# EAGLE design rear_wheel_encoder (EAGLE 7.6.0)
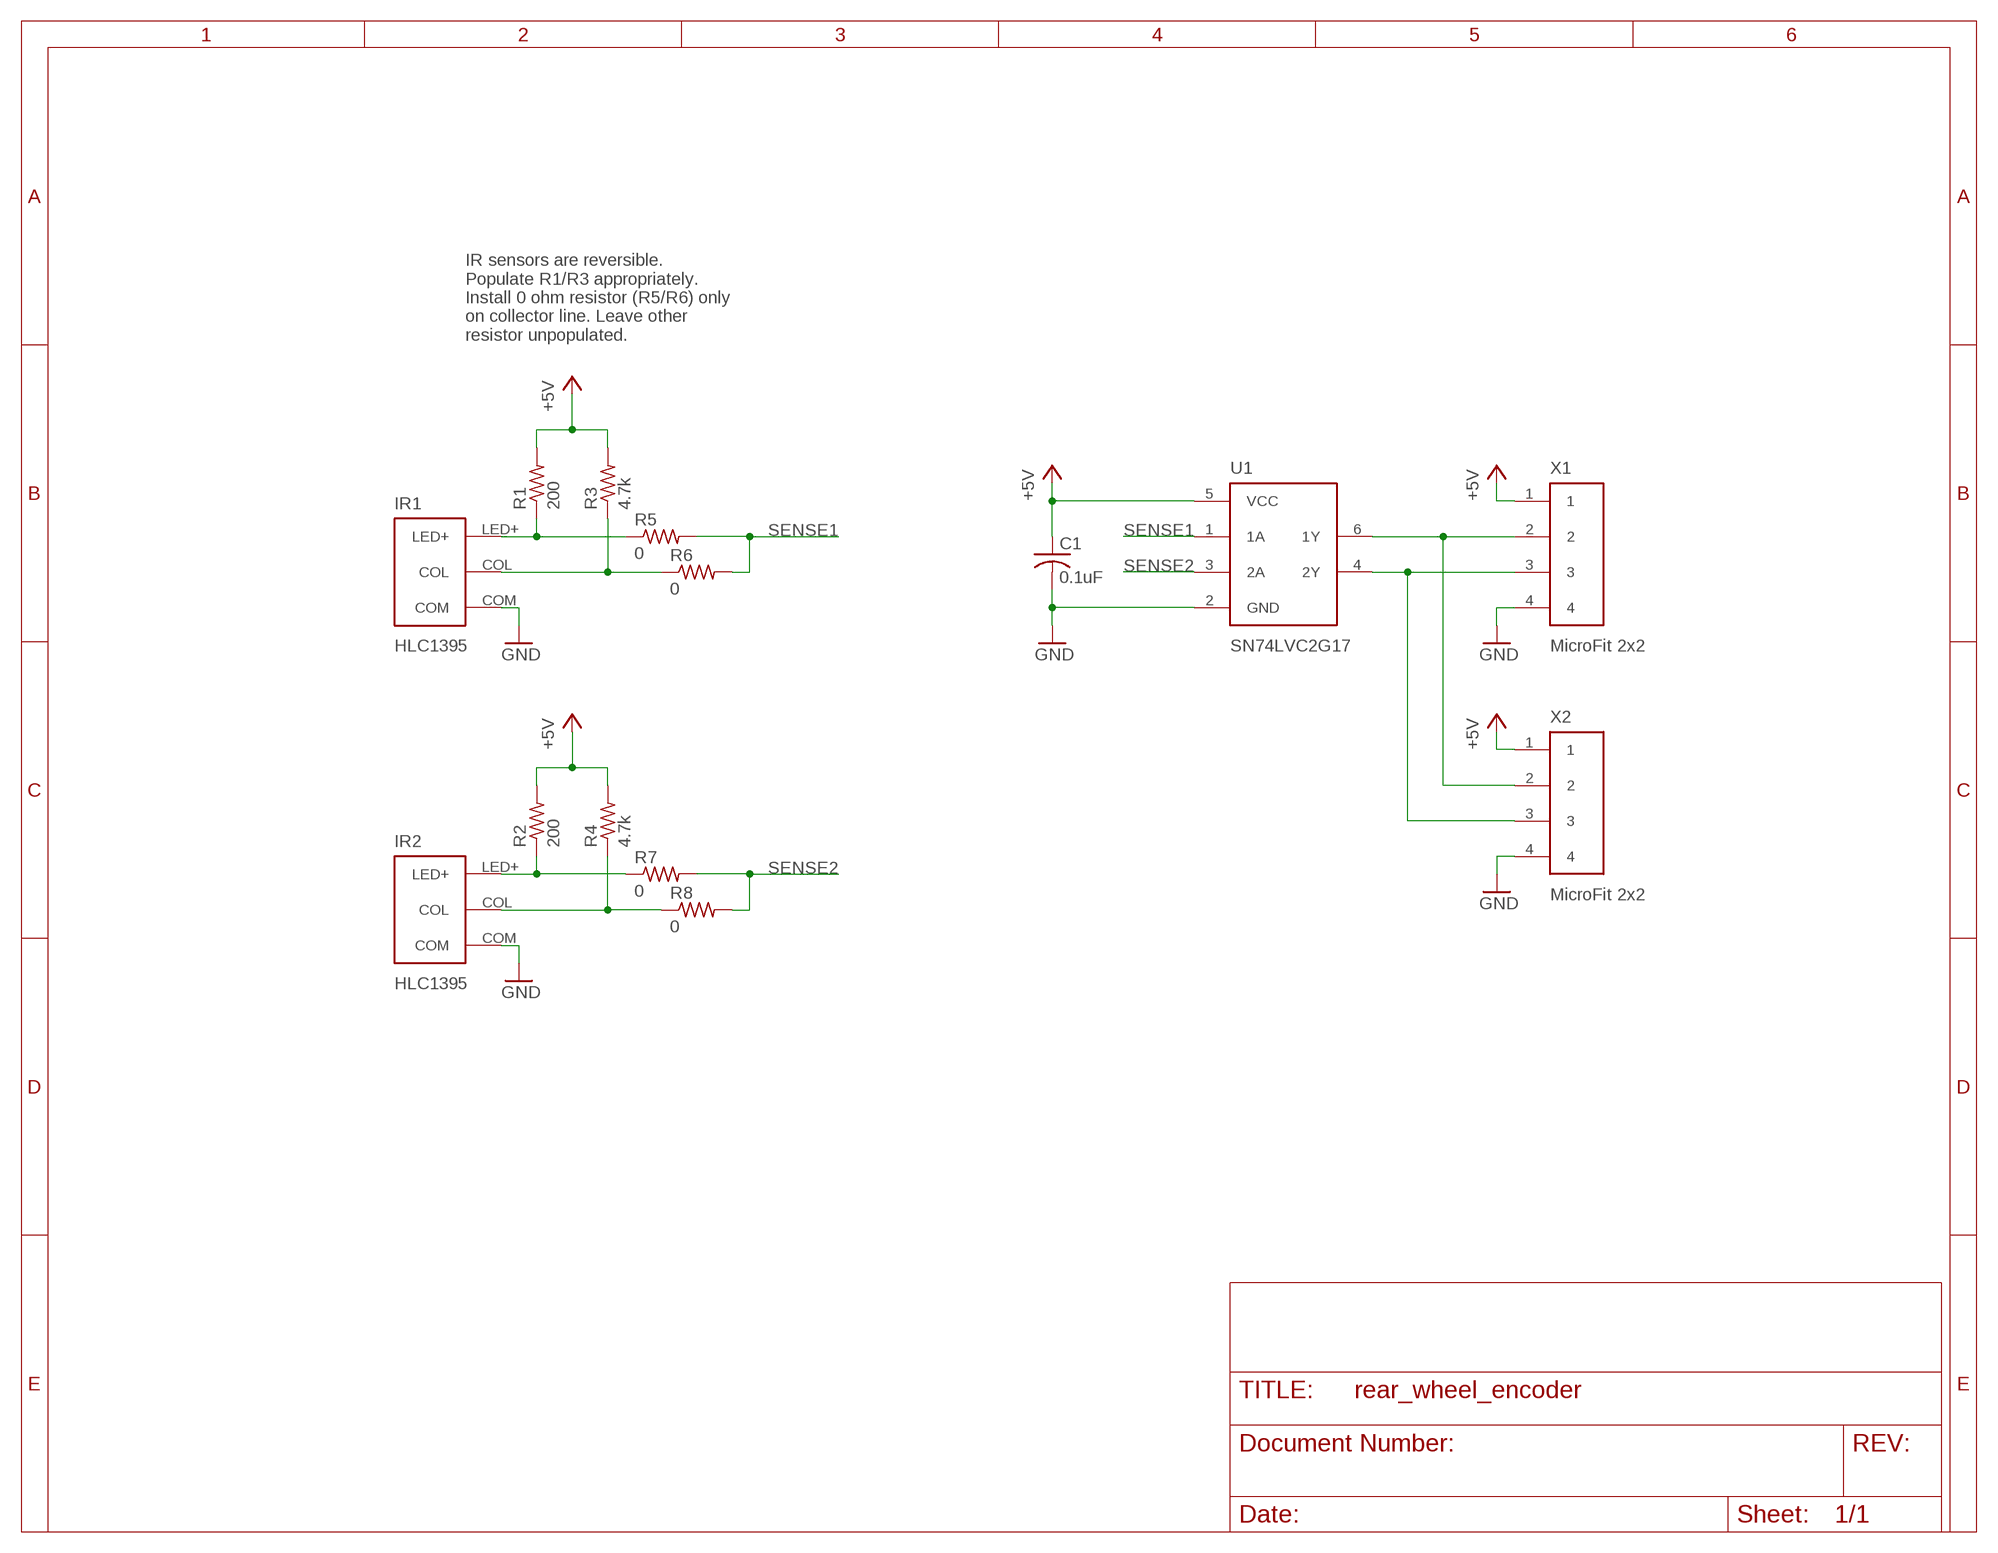
[diagram p0: schematic, sheet 1]

## Parts
C1  0.1uF  C-USC0603  [C0603]
IR1  HLC1395  [HLC1395]
IR2  HLC1395  [HLC1395]
R1  200  R-US_R0603  [R0603]
R2  200  R-US_R0603  [R0603]
R3  4.7k  R-US_R0603  [R0603]
R4  4.7k  R-US_R0603  [R0603]
R5  0  R-US_R0603  [R0603]
R6  0  R-US_R0603  [R0603]
R7  0  R-US_R0603  [R0603]
R8  0  R-US_R0603  [R0603]
U1  SN74LVC2G17DBVR  [SOT-23-6]
X1  MICROFIT-2X2-SMD  [MICROFIT-2X2-0430450411]
X2  MICROFIT-2X2-SMD  [MICROFIT-2X2-0430450411]

## Nets
+5V: C1.1 R1.2 R2.2 R3.2 R4.2 U1.5(VCC) X1.1 X2.1
GND: C1.2 IR1.COM IR2.COM U1.2(GND) X1.4 X2.4
N$1: IR1.LED+ R1.1 R5.1
N$2: IR2.LED+ R2.1 R7.1
N$3: IR2.COL R4.1 R8.1
N$4: U1.4(2Y) X1.3 X2.3
N$5: U1.6(1Y) X1.2 X2.2
N$6: IR1.COL R3.1 R6.1
SENSE1: R5.2 R6.2 U1.1(1A)
SENSE2: R7.2 R8.2 U1.3(2A)

## Notes on the sheet
- IR sensors are reversible.
  Populate R1/R3 appropriately.
  Install 0 ohm resistor (R5/R6) only
  on collector line. Leave other
  resistor unpopulated.

## Library data of the parts
C1 = resistor:C-US: CAPACITOR, American symbol
IR1 IR2 = rover12:HLC1395
R1-R8 = resistor:R-US_: RESISTOR, American symbol
U1 = rover12:SN74LVC2G17DBVR
X1 X2 = rover12:MICROFIT-2X2-SMD

## Board
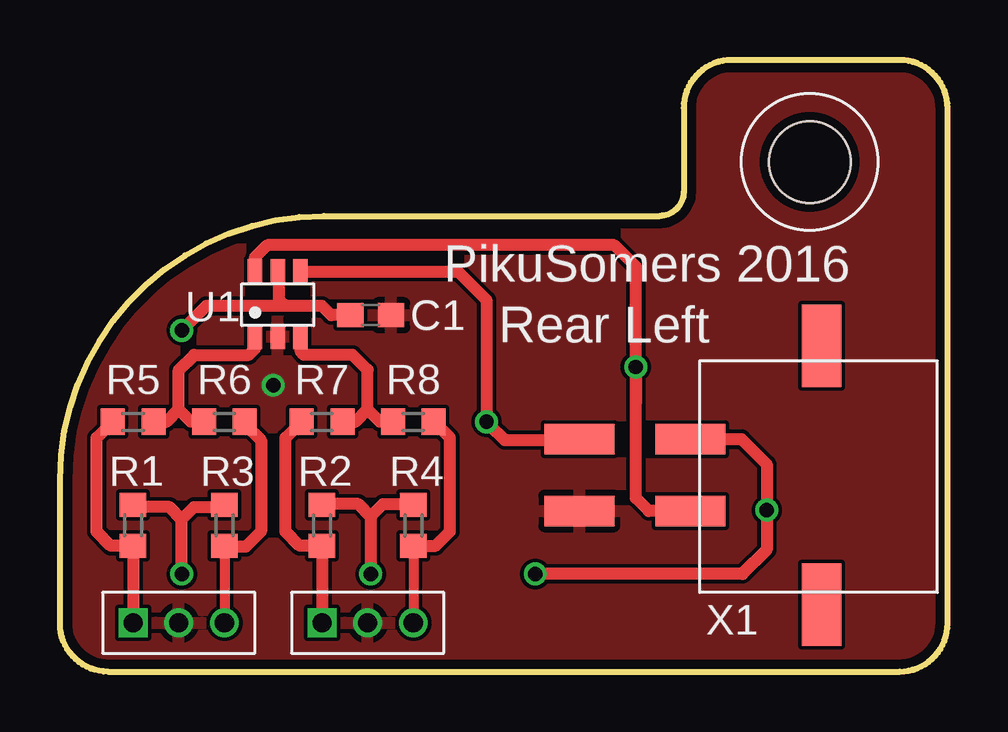
[diagram p1: board, top side]
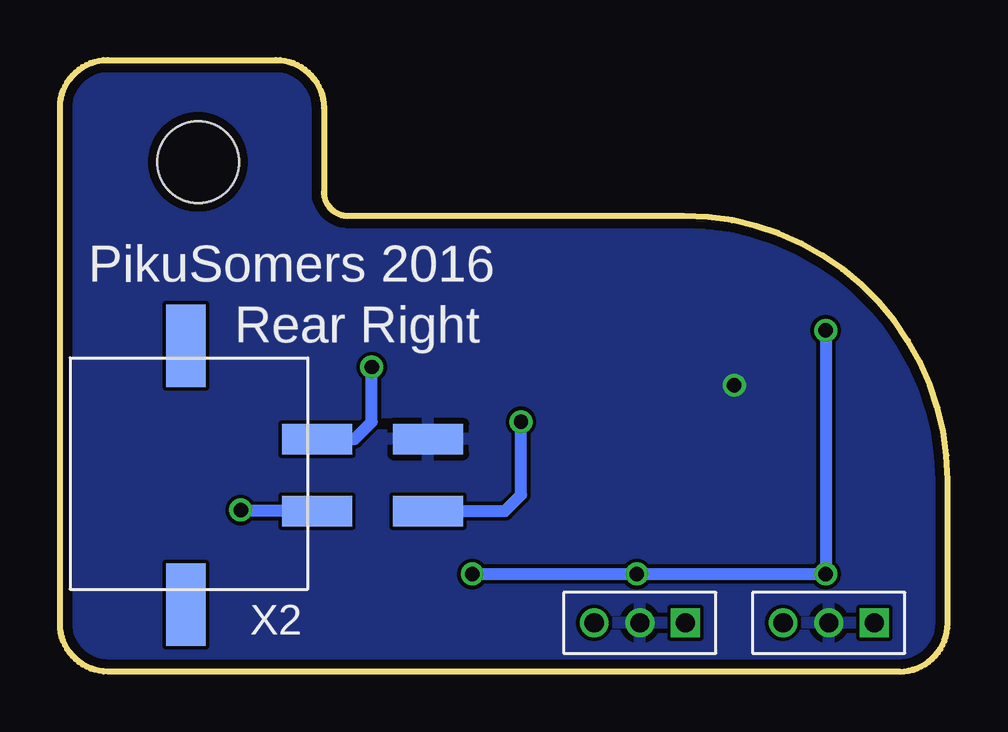
[diagram p2: board, bottom side, seen from below]

Size 37 x 25.5 mm. Coordinates in mm from the lower left corner, seen from the top.
Outline: 2,0 35,0 arc90 37,2 37,23.5 arc90 35,25.5 28,25.5 arc90 26,23.5 26,20 arc-90 25,19 11,19 arc90 0,8 0,2 arc90 2,0
Copper layers (1*16): Top 0.0356mm / dielectric 1.5011mm / Bottom 0.0356mm
Design rules "oshpark-2layer": minimum track width 6mil, minimum drill 13mil, track to track 6mil, track to pad 6mil, pad to pad 6mil, via to via 6mil, smd to smd 6mil, copper to edge 15mil, drill to drill 6mil, minimum pad ring 7mil, minimum via ring 7mil, stop-mask expansion 2.5mil, vias tented up to drill 0mil, thermal gap 10mil
Holes 3.4 mm at 31.25,21.25

### Footprints (pad centres in the part's own frame; a part is rotated, then mirrored left to right if it is on the bottom)
C0603 = smd 1.1 x 1: 1 -0.85,0; 2 0.85,0
HLC1395 = drill 0.8: COL 3.81,0; COM 1.905,0 | drill 0.8 square: LED+ 0,0
R0603 = smd 1 x 1.1: 1 -0.85,0; 2 0.85,0
SOT-23-6 = smd 0.6 x 1.05: 1 0,0; 2 0.95,0; 3 1.9,0; 4 1.9,2.7; 5 0.95,2.7; 6 0,2.7
MICROFIT-2X2-0430450411 = smd 1.27 x 2.921: 1 6.896,5.474; 2 3.899,5.474; 3 6.896,10.097; 4 3.899,10.097 | smd 3.429 x 1.651: NC1 0,0; NC2 10.795,0

### Placement (x,y rotation side)
C1  12.95,14.86 0 top
IR1  3.05,2.03 0 top
IR2  10.92,2.03 0 top
R1  3.05,6.1 90 top
R2  10.92,6.1 90 top
R3  6.86,6.1 90 top
R4  14.73,6.1 90 top
R5  3.05,10.41 0 top
R6  6.86,10.41 180 top
R7  10.92,10.41 0 top
R8  14.73,10.41 180 top
U1  8.13,13.97 0 top
X1  31.75,2.79 90 top
X2  31.75,13.59 270 bottom

### Tracks (layer width: path | path; a pad name or v marks a point on that pad's centre or on a via)
+5V  (via drill 0.6)
  Top 0.508: X1.1 28.41,9.69 29.46,8.64 v29.46,6.73 29.46,5.08 28.45,4.06 v19.81,4.06 | v5.08,4.06 5.08,6.35 | 5.08,6.35 4.57,6.86 3.14,6.86 R1.2 | 5.08,6.35 5.59,6.86 6.77,6.86 R3.2 | 12.95,6.48 v12.95,4.06 | 12.95,6.48 12.45,6.99 10.92,6.99 R2.2 10.96,6.99 | 12.95,6.48 13.46,6.99 14.69,6.99 R4.2 | C1.1 11.3,14.86 10.92,15.24 9.4,15.24 | U1.5 9.14,16.6 9.14,15.49 9.4,15.24 | 9.4,15.24 6.1,15.24 v5.08,14.22
  Bottom 0.508: v19.81,4.06 v12.95,4.06 v5.08,4.06 v5.08,14.22 | X2.1 29.43,6.69 v29.46,6.73
GND  (via drill 0.6)
  other vias: 8.89,11.94
  pour Top: 11.18,19.05 arc90 0,7.87 0,2.03 arc90 2.03,0 2.29,0 35.05,0 arc90 37.08,2.03 37.08,2.29 37.08,23.62 arc90 35.05,25.65 34.54,25.65 27.94,25.65 arc90 25.91,23.62 25.91,20.32 arc-90 24.64,19.05 23.37,19.05
  pour Bottom: 0,2.03 arc90 2.03,0 2.29,0 35.05,0 arc90 37.08,2.03 37.08,23.62 arc90 35.05,25.65 34.8,25.65 27.94,25.65 arc90 25.91,23.62 25.91,20.32 arc-90 24.64,19.05 24.38,19.05 10.67,19.05 arc90 0,8.38 0,8.13
N$1
  Top 0.508: IR1.LED+ R1.1 2.12,5.25 1.52,5.84 1.52,9.74 R5.1
N$2
  Top 0.508: IR2.LED+ R2.1 9.99,5.25 9.4,5.84 9.4,9.74 R7.1
N$3
  Top 0.406: R4.1 IR2.COL
  Top 0.508: R4.1 15.66,5.25 16.26,5.84 16.26,9.74 R8.1
N$4  (via drill 0.6)
  Top 0.508: U1.4 16.6,16.67 17.78,15.49 v17.78,10.41 17.91,10.29 18.54,9.65 21.61,9.65 X1.3
  Bottom 0.508: X2.3 18.45,6.69 17.78,7.37 v17.78,10.41
N$5  (via drill 0.6)
  Top 0.508: X1.2 24.55,6.69 24,7.24 v24,12.7 | v24,12.7 24,16.89 23.11,17.78 8.64,17.78 8.13,17.27 U1.6 | v24,12.7 24,11.18
  Bottom 0.508: X2.2 24.73,9.69 24,10.41 v24,12.7
N$6
  Top 0.406: R6.1 7.71,10.33 | 6.9,5.21 R3.1 IR1.COL
  Top 0.508: 7.71,10.33 8.38,9.65 8.38,5.84 7.75,5.21 6.9,5.21
SENSE1
  Top 0.508: R5.2 4.45,10.41 4.95,10.92 | 4.95,10.92 4.95,12.57 5.59,13.21 7.87,13.21 8.13,13.46 U1.1 | R6.2 5.46,10.41 4.95,10.92
SENSE2
  Top 0.508: R7.2 12.32,10.41 12.83,10.92 | 12.83,10.92 12.83,12.57 12.19,13.21 10.16,13.21 10.03,13.34 U1.3 | R8.2 13.34,10.41 12.83,10.92

### Text on the board
tPlace: PikuSomers 2016 | Rear Left
bPlace: PikuSomers 2016 | Rear Right